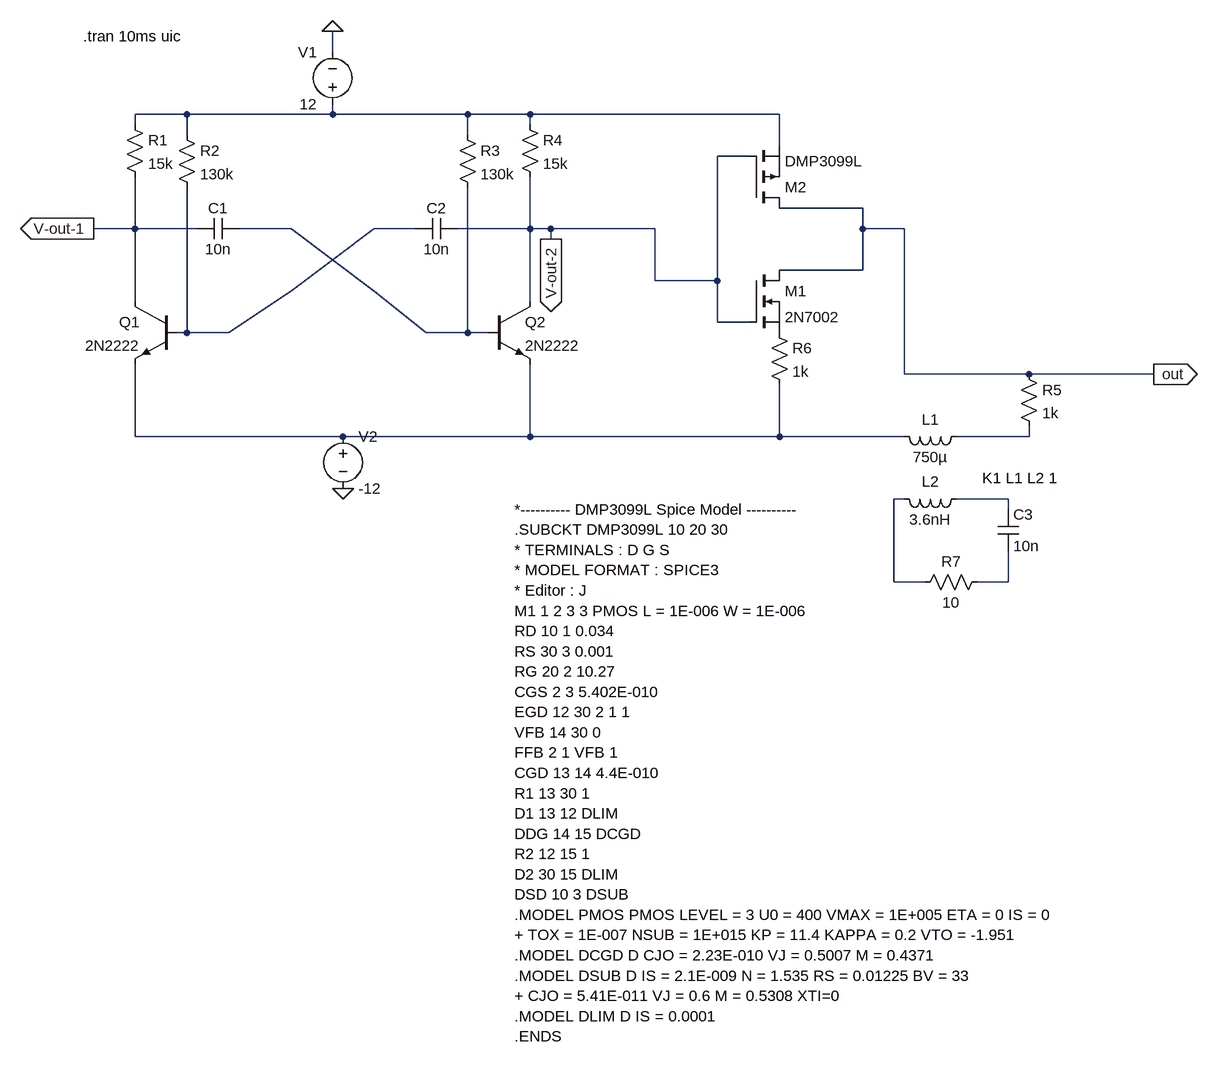
[diagram p0: schematic astable-multivibrator-sqr-12v.asc]
astable-multivibrator-sqr-12v.asc, the LTspice schematic file:
Version 4.1
SHEET 1 1084 1512
WIRE -320 64 -320 32
WIRE -544 160 -624 160
WIRE -320 160 -320 144
WIRE -320 160 -544 160
WIRE -112 160 -320 160
WIRE -16 160 -112 160
WIRE 368 160 -16 160
WIRE -624 176 -624 160
WIRE -16 176 -16 160
WIRE -544 192 -544 160
WIRE -112 192 -112 160
WIRE 368 208 368 160
WIRE 320 224 272 224
WIRE 496 304 368 304
WIRE -624 336 -624 256
WIRE -624 336 -688 336
WIRE -528 336 -624 336
WIRE -384 336 -464 336
WIRE -192 336 -256 336
WIRE -16 336 -16 256
WIRE -16 336 -128 336
WIRE 16 336 -16 336
WIRE 176 336 16 336
WIRE 496 336 496 304
WIRE 560 336 496 336
WIRE 16 352 16 336
WIRE 496 400 496 336
WIRE 496 400 368 400
WIRE 176 416 176 336
WIRE 272 416 272 224
WIRE 272 416 176 416
WIRE -384 432 -256 336
WIRE -256 432 -384 336
WIRE -624 448 -624 336
WIRE -16 448 -16 336
WIRE 272 480 272 416
WIRE 320 480 272 480
WIRE -544 496 -544 272
WIRE -544 496 -560 496
WIRE -480 496 -384 432
WIRE -480 496 -544 496
WIRE -176 496 -256 432
WIRE -112 496 -112 272
WIRE -112 496 -176 496
WIRE -80 496 -112 496
WIRE 560 560 560 336
WIRE 752 560 560 560
WIRE 944 560 752 560
WIRE -624 656 -624 544
WIRE -304 656 -624 656
WIRE -16 656 -16 544
WIRE -16 656 -304 656
WIRE 368 656 368 576
WIRE 368 656 -16 656
WIRE 560 656 368 656
WIRE 752 656 752 640
WIRE 752 656 640 656
WIRE 560 752 544 752
WIRE 720 752 640 752
WIRE 720 768 720 752
WIRE 544 880 544 752
WIRE 592 880 544 880
WIRE 720 880 720 832
WIRE 720 880 672 880
FLAG -320 32 0
FLAG 16 352 V-out-2
IOPIN 16 352 Out
FLAG -688 336 V-out-1
IOPIN -688 336 Out
FLAG -304 736 0
FLAG 944 560 out
IOPIN 944 560 Out
SYMBOL Res -640 160 R0
SYMATTR InstName R1
SYMATTR Value 15k
SYMBOL Voltage -320 160 R180
WINDOW 0 24 96 Left 2
WINDOW 3 24 16 Left 2
WINDOW 123 0 0 Left 0
WINDOW 39 0 0 Left 0
SYMATTR InstName V1
SYMATTR Value 12
SYMBOL Res -32 160 R0
SYMATTR InstName R4
SYMATTR Value 15k
SYMBOL Cap -128 320 R90
WINDOW 0 0 32 VBottom 2
WINDOW 3 32 32 VTop 2
SYMATTR InstName C2
SYMATTR Value 10n
SYMBOL Cap -464 320 R90
WINDOW 0 0 32 VBottom 2
WINDOW 3 32 32 VTop 2
SYMATTR InstName C1
SYMATTR Value 10n
SYMBOL npn -560 448 M0
SYMATTR InstName Q1
SYMATTR Value 2N2222
SYMBOL npn -80 448 R0
SYMATTR InstName Q2
SYMATTR Value 2N2222
SYMBOL Res -128 176 R0
SYMATTR InstName R3
SYMATTR Value 130k
SYMBOL Res -560 176 R0
SYMATTR InstName R2
SYMATTR Value 130k
SYMBOL voltage -304 640 R0
WINDOW 123 0 0 Left 0
WINDOW 39 0 0 Left 0
SYMATTR InstName V2
SYMATTR Value -12
SYMBOL nmos 320 400 R0
SYMATTR InstName M1
SYMATTR Value 2N7002
SYMBOL pmos 320 304 M180
SYMATTR InstName M2
SYMATTR Value DMP3099L
SYMATTR Prefix X
SYMBOL res 736 544 R0
SYMATTR InstName R5
SYMATTR Value 1k
SYMBOL res 352 480 R0
SYMATTR InstName R6
SYMATTR Value 1k
SYMBOL ind 656 640 R90
WINDOW 0 5 56 VBottom 2
WINDOW 3 32 56 VTop 2
SYMATTR InstName L1
SYMATTR Value 750µ
SYMATTR Type ind
SYMATTR SpiceLine Rser=1m
SYMBOL ind 656 736 R90
WINDOW 0 5 56 VBottom 2
WINDOW 3 32 56 VTop 2
SYMATTR InstName L2
SYMATTR Value 3.6nH
SYMATTR Type ind
SYMATTR SpiceLine Rser=1m
SYMBOL cap 704 768 R0
SYMATTR InstName C3
SYMATTR Value 10n
SYMBOL res 688 864 R90
WINDOW 0 0 56 VBottom 2
WINDOW 3 32 56 VTop 2
SYMATTR InstName R7
SYMATTR Value 10
TEXT -704 40 Left 2 !.tran 10ms uic
TEXT -40 768 Left 2 !*---------- DMP3099L Spice Model ----------\n.SUBCKT DMP3099L 10 20 30\n* TERMINALS : D G S\n* MODEL FORMAT : SPICE3\n* Editor : J\nM1 1 2 3 3 PMOS L = 1E-006 W = 1E-006\nRD 10 1 0.034\nRS 30 3 0.001\nRG 20 2 10.27\nCGS 2 3 5.402E-010\nEGD 12 30 2 1 1\nVFB 14 30 0\nFFB 2 1 VFB 1\nCGD 13 14 4.4E-010\nR1 13 30 1\nD1 13 12 DLIM\nDDG 14 15 DCGD\nR2 12 15 1\nD2 30 15 DLIM\nDSD 10 3 DSUB\n.MODEL PMOS PMOS LEVEL = 3 U0 = 400 VMAX = 1E+005 ETA = 0 IS = 0\n+ TOX = 1E-007 NSUB = 1E+015 KP = 11.4 KAPPA = 0.2 VTO = -1.951\n.MODEL DCGD D CJO = 2.23E-010 VJ = 0.5007 M = 0.4371\n.MODEL DSUB D IS = 2.1E-009 N = 1.535 RS = 0.01225 BV = 33\n+ CJO = 5.41E-011 VJ = 0.6 M = 0.5308 XTI=0\n.MODEL DLIM D IS = 0.0001\n.ENDS
TEXT 680 720 Left 2 !K1 L1 L2 1

The netlist it stands for:
* astable-multivibrator-sqr-12v.asc
R1 N001 V-out-1 15k
V1 N001 0 12
R4 N001 V-out-2 15k
C2 V-out-2 N003 10n
C1 N002 V-out-1 10n
Q1 V-out-1 N003 N004 0 2N2222
Q2 V-out-2 N002 N004 0 2N2222
R3 N001 N002 130k
R2 N001 N003 130k
V2 N004 0 -12
M1 out V-out-2 P001 P001 2N7002
X§M2 out V-out-2 N001 DMP3099L  ; pins D G S
R5 out N005 1k
R6 P001 N004 1k
L1 N005 N004 750µ Rser=1m
L2 N007 N006 3.6nH Rser=1m
C3 N007 N008 10n
R7 N008 N006 10
.model NPN NPN
.model PNP PNP
.lib standard.bjt
.model NMOS NMOS
.model PMOS PMOS
.lib standard.mos
.tran 10ms uic
*---------- DMP3099L Spice Model ----------
.SUBCKT DMP3099L 10 20 30
* TERMINALS : D G S
* MODEL FORMAT : SPICE3
* Editor : J
M1 1 2 3 3 PMOS L = 1E-006 W = 1E-006
RD 10 1 0.034
RS 30 3 0.001
RG 20 2 10.27
CGS 2 3 5.402E-010
EGD 12 30 2 1 1
VFB 14 30 0
FFB 2 1 VFB 1
CGD 13 14 4.4E-010
R1 13 30 1
D1 13 12 DLIM
DDG 14 15 DCGD
R2 12 15 1
D2 30 15 DLIM
DSD 10 3 DSUB
.MODEL PMOS PMOS LEVEL = 3 U0 = 400 VMAX = 1E+005 ETA = 0 IS = 0
+ TOX = 1E-007 NSUB = 1E+015 KP = 11.4 KAPPA = 0.2 VTO = -1.951
.MODEL DCGD D CJO = 2.23E-010 VJ = 0.5007 M = 0.4371
.MODEL DSUB D IS = 2.1E-009 N = 1.535 RS = 0.01225 BV = 33
+ CJO = 5.41E-011 VJ = 0.6 M = 0.5308 XTI=0
.MODEL DLIM D IS = 0.0001
.ENDS
K1 L1 L2 1
.backanno
.end